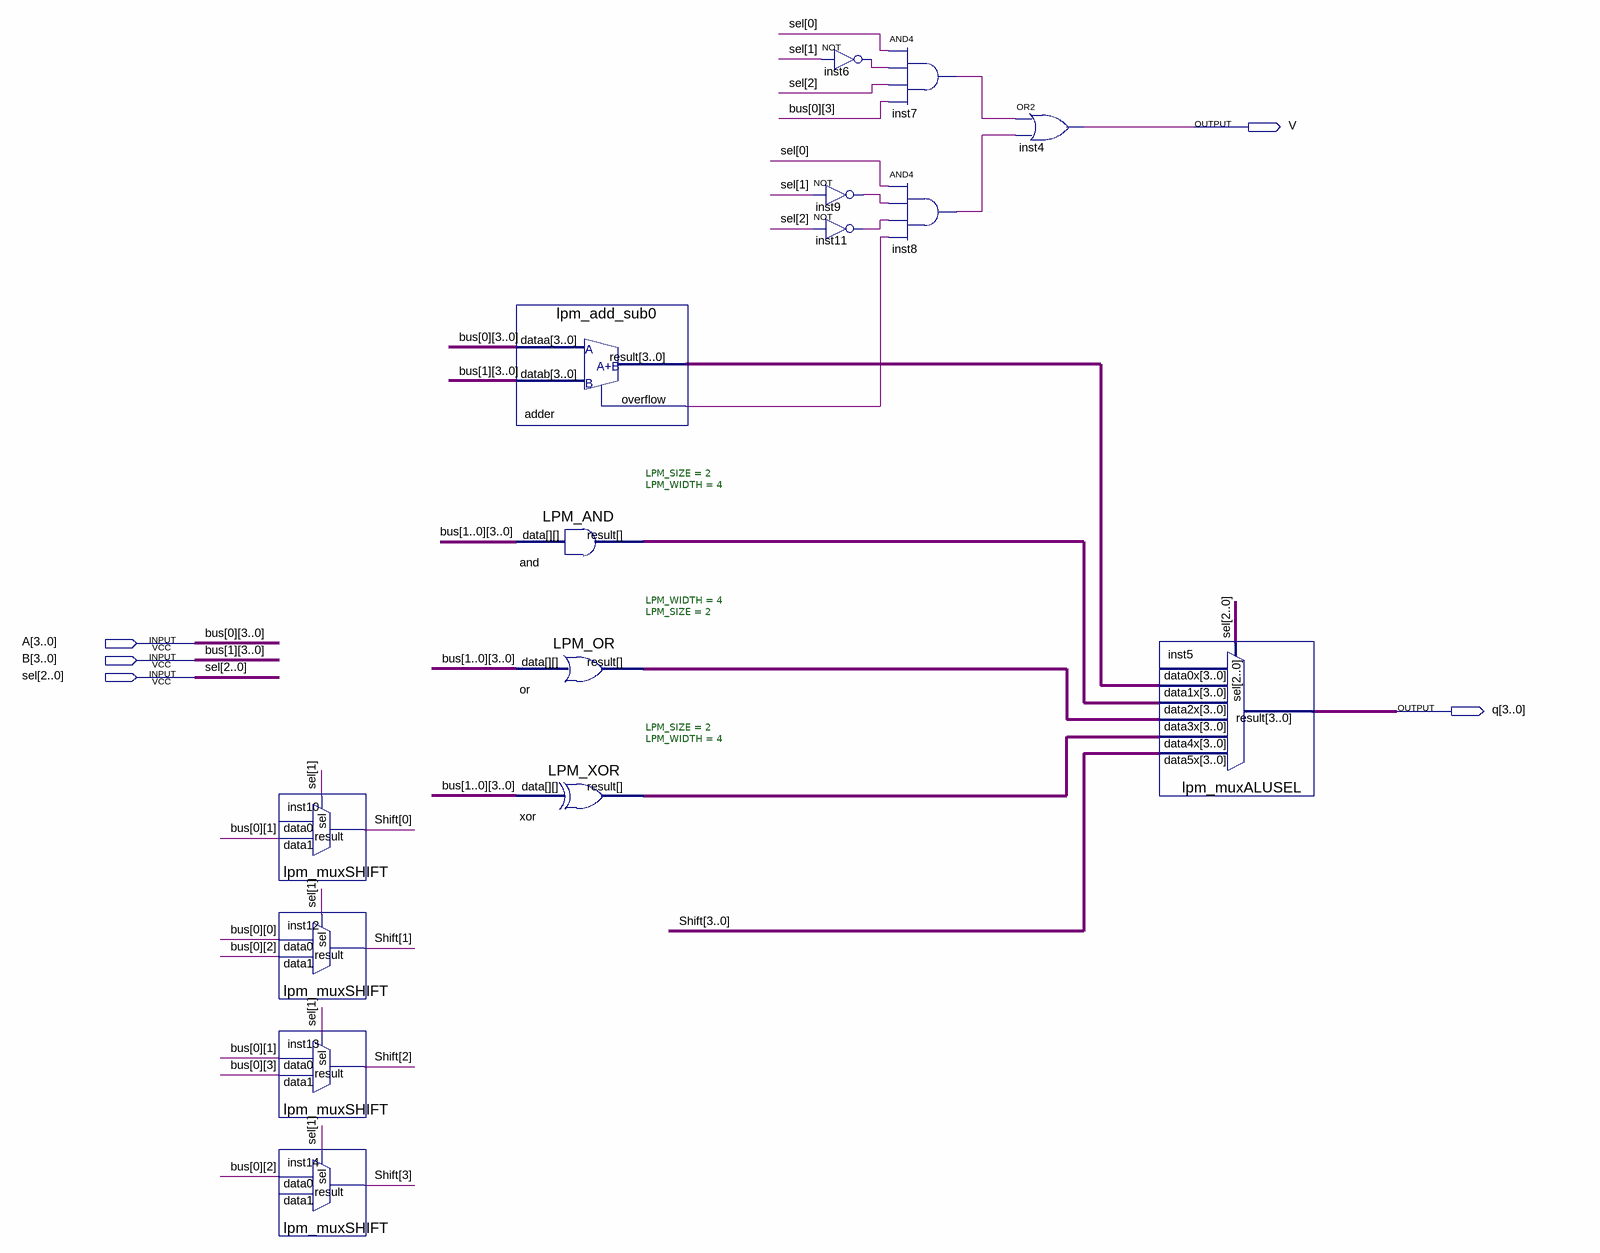
[diagram p0: schematic sheet]
// Quartus schematic ALU.bdf as structural Verilog: 15 symbols, 5 pins
module ALU (
  input  [3:0] A,
  input  [3:0] B,
  input  [2:0] sel,
  output V,
  output [3:0] q
);

  wire adder_overflow, inst6_out, inst7_out, inst8_out, inst9_out, inst11_out;
  wire [3:0] adder_result, and_result, or_result, Shift, xor_result;

  lpm_muxSHIFT inst10 (.data1(A[1]), .sel(sel[1]), .result(Shift[0]));  // open: data0
  lpm_muxSHIFT inst12 (.data1(A[2]), .data0(A[0]), .sel(sel[1]), .result(Shift[1]));
  lpm_muxSHIFT inst13 (.data1(A[3]), .data0(A[1]), .sel(sel[1]), .result(Shift[2]));
  lpm_muxSHIFT inst14 (.data0(A[2]), .sel(sel[1]), .result(Shift[3]));  // open: data1
  lpm_add_sub0 adder (.dataa(A), .datab(B), .result(adder_result), .overflow(adder_overflow));
  LPM_AND #(.LPM_SIZE(2), .LPM_WIDTH(4)) \and  (.data({B, A}), .result(and_result));
  LPM_OR #(.LPM_WIDTH(4), .LPM_SIZE(2)) \or  (.data({B, A}), .result(or_result));
  LPM_XOR #(.LPM_SIZE(2), .LPM_WIDTH(4)) \xor  (.data({B, A}), .result(xor_result));
  not inst6 (inst6_out, sel[1]);
  not inst9 (inst9_out, sel[1]);
  not inst11 (inst11_out, sel[2]);
  and inst7 (inst7_out, sel[0], inst6_out, sel[2], A[3]);
  and inst8 (inst8_out, sel[0], inst9_out, inst11_out, adder_overflow);
  or inst4 (V, inst7_out, inst8_out);
  lpm_muxALUSEL inst5 (
    .data5x(Shift), .data4x(xor_result), .data3x(or_result), .data2x(and_result), .data1x(adder_result),
    .sel(sel), .result(q));  // open: data0x

  // Other names for the same wires on the sheet: bus_0[3:0] = A; bus_1[3:0] = B
endmodule
